# Altium schematic sheet stm32_project.SchDoc
size A1; SheetNumber: 1; SheetTotal: 1
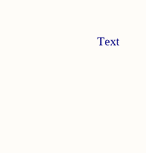
[diagram p0: stm32_project.SchDoc, top left]
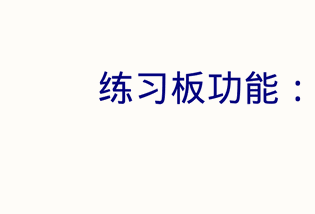
[diagram p1: stm32_project.SchDoc, top right]
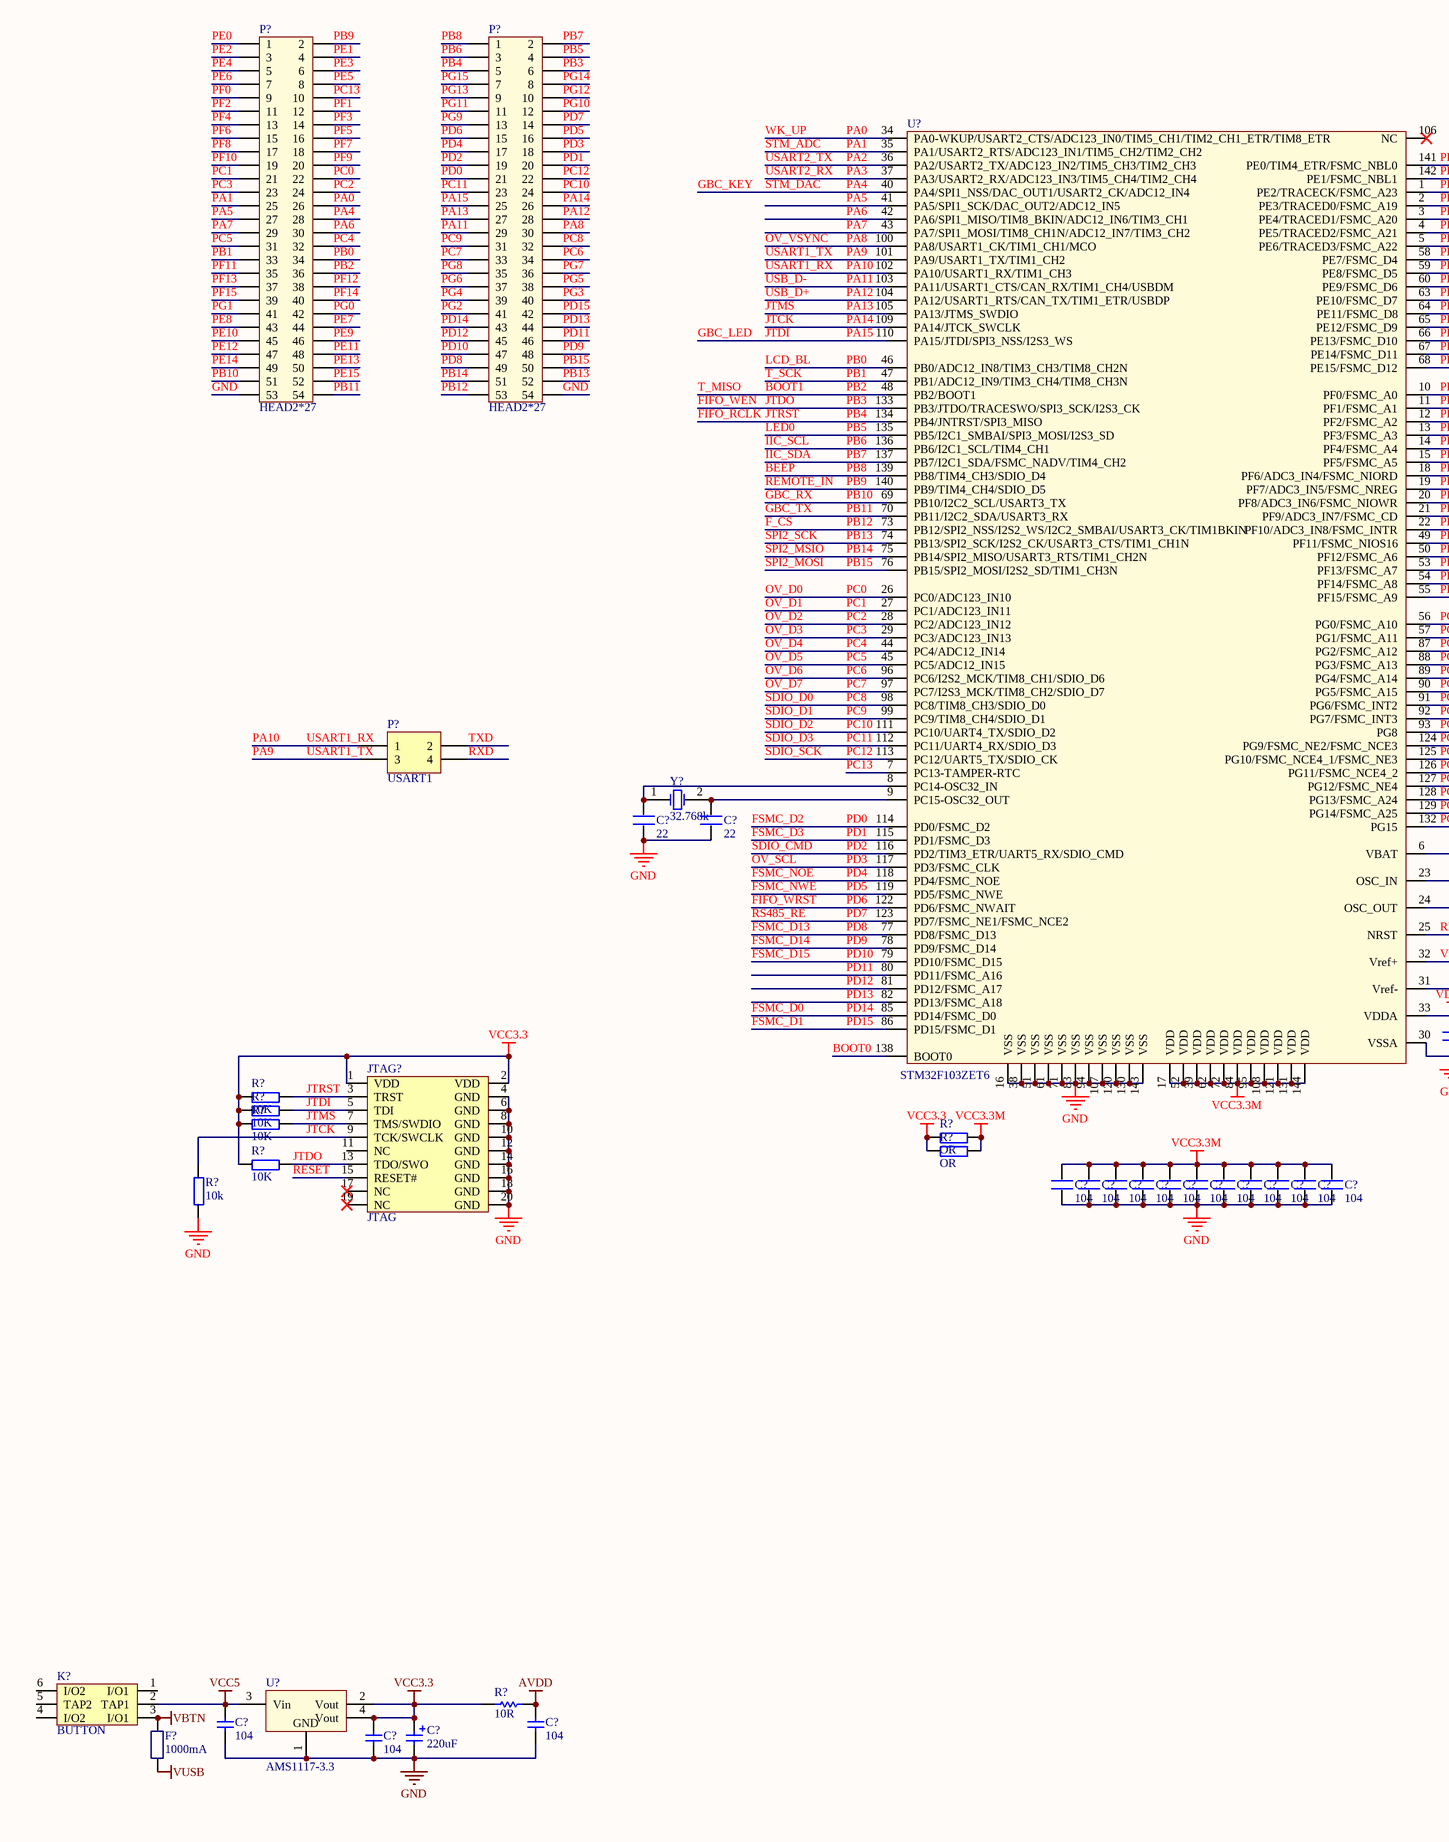
[diagram p2: stm32_project.SchDoc, bottom left]
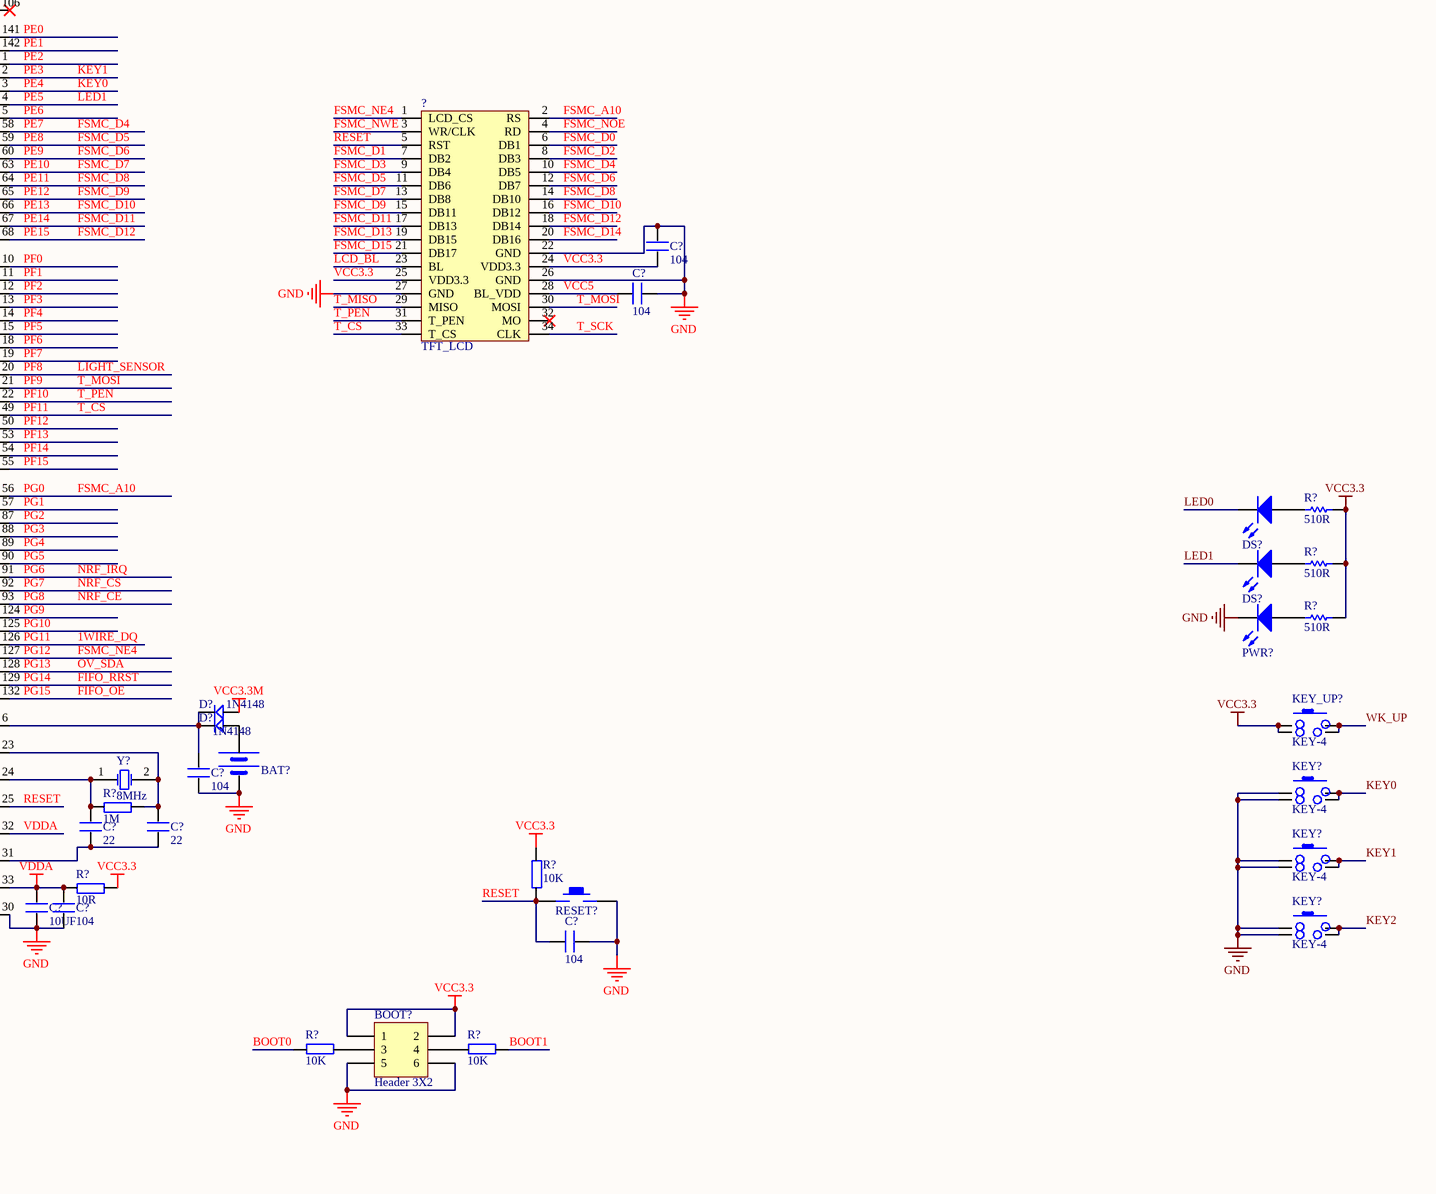
[diagram p3: stm32_project.SchDoc, bottom right]

## Parts
(Parts that share a designator on the sheet are numbered #1, #2 ... from top to bottom, then left to right.)
?  TFT_LCD  [db2*17-4.3]
BAT?  BATT  [CR1220_B]  (value not drawn)
BOOT?  Header 3X2  [HDR-3X2]
C?#1  104  [C 0603]
C?#2  104  [C 0603]
C?#3  22  [C 0603]
C?#4  22  [C 0603]
C?#5  104  [C 0603]
C?#6  22  [C 0603]
C?#7  22  [C 0603]
C?#8  104  [C 0603]
C?#9  10UF  [C 0805]
C?#10  104  [C 0603]
C?#11  104  [C 0603]
C?#12  104  [C 0603]
C?#13  104  [C 0603]
C?#14  104  [C 0603]
C?#15  104  [C 0603]
C?#16  104  [C 0603]
C?#17  104  [C 0603]
C?#18  104  [C 0603]
C?#19  104  [C 0603]
C?#20  104  [C 0603]
C?#21  104  [C 0603]
C?#22  104  [CAP[0603]]
C?#23  220uF  [R_6_3_h_7_7]
C?#24  104  [CAP[0603]]
C?#25  104  [CAP[0603]]
D?#1  1N4148  [MINI_MELF (LL34)]
D?#2  1N4148  [MINI_MELF (LL34)]
DS?#1  LED  [LED[0805]]  (value not drawn)
DS?#2  LED  [LED[0805]]  (value not drawn)
F?  1000mA  [PTC[0805]]
JTAG?  JTAG  [IDC2.54-20P]
K?  BUTTON  [KEY-6]
KEY?#1  KEY-4  [KEY-4(DIP)]
KEY?#2  KEY-4  [KEY-4(DIP)]
KEY?#3  KEY-4  [KEY-4(DIP)]
KEY_UP?  KEY-4  [KEY-4(DIP)]
P?#1  HEAD2*27  [HEAD2*27]
P?#2  HEAD2*27  [HEAD2*27]
P?#3  USART1  [HDR-2X2]
PWR?  LED  [LED[0805]]  (value not drawn)
R?#1  510R  [RES[0603]]
R?#2  510R  [RES[0603]]
R?#3  510R  [RES[0603]]
R?#4  1M  [R 0603]
R?#5  10R  [R 0603]
R?#6  10K  [R 0603]
R?#7  10K  [R 0603]
R?#8  10K  [R 0603]
R?#9  OR  [R 0603]
R?#10  OR  [R 0603]
R?#11  10K  [R 0603]
R?#12  10K  [R 0603]
R?#13  10K  [R 0603]
R?#14  10K  [R 0603]
R?#15  10k  [R 0603]
R?#16  10R  [RES[0603]]
RESET?  KEY_M  [TSW DIP-6*6*5]  (value not drawn)
U?#1  STM32F103ZET6  [TQFP144 20x20_L]
U?#2  AMS1117-3.3  [SOT-223(AMS1117-3.3)]
Y?#1  32.768k  [XTAL32]
Y?#2  8MHz  [XTAL-49S DIP]

## Nets
AVDD: C?#24.2 R?#16.2
GND: ?.22(GND) ?.26(GND) ?.27(GND) BAT?.2(GND) BOOT?.5 BOOT?.6 C?#1.1 C?#2.1 C?#3.1 C?#4.1 C?#5.1 C?#8.2 C?#9.1 C?#10.1 C?#11.1 C?#12.1 C?#13.1 C?#14.1 C?#15.1 C?#16.1 C?#17.1 C?#18.1 C?#19.1 C?#20.1 C?#21.1 C?#22.1 C?#23.2 C?#24.1 C?#25.1 JTAG?.4(GND) JTAG?.6(GND) JTAG?.8(GND) JTAG?.10(GND) JTAG?.12(GND) JTAG?.14(GND) JTAG?.16(GND) JTAG?.18(GND) JTAG?.20(GND) KEY?#1.1 KEY?#1.2 KEY?#2.1 KEY?#2.2 KEY?#3.1 KEY?#3.2 P?#1.53 P?#2.54 PWR?.2(K) R?#15.1 RESET?.2 U?#1.16(VSS) U?#1.30(VSSA) U?#1.38(VSS) U?#1.51(VSS) U?#1.61(VSS) U?#1.71(VSS) U?#1.83(VSS) U?#1.94(VSS) U?#1.107(VSS) U?#1.120(VSS) U?#1.130(VSS) U?#1.143(VSS) U?#2.1(GND)
VBTN: F?.2 K?.3(I/O1)
VCC3.3: ?.24(VDD3.3) ?.25(VDD3.3) BOOT?.1 BOOT?.2 C?#1.2 C?#23.1 C?#25.2 JTAG?.1(VDD) JTAG?.2(VDD) KEY_UP?.1 KEY_UP?.2 R?#1.2 R?#2.2 R?#3.2 R?#5.2 R?#6.1 R?#7.1 R?#8.1 R?#9.1 R?#10.1 R?#11.1 R?#12.2 R?#16.1 U?#2.2(Vout) U?#2.4(Vout)
VCC3.3M: C?#11.2 C?#12.2 C?#13.2 C?#14.2 C?#15.2 C?#16.2 C?#17.2 C?#18.2 C?#19.2 C?#20.2 C?#21.2 D?#1.1 R?#9.2 R?#10.2 U?#1.17(VDD) U?#1.39(VDD) U?#1.52(VDD) U?#1.62(VDD) U?#1.72(VDD) U?#1.84(VDD) U?#1.95(VDD) U?#1.108(VDD) U?#1.121(VDD) U?#1.131(VDD) U?#1.144(VDD)
VCC5: ?.28(BL_VDD) C?#2.2 C?#22.2 K?.2(TAP1) U?#2.3(Vin)
VDDA: C?#9.2 C?#10.2 R?#5.1 U?#1.32(Vref+) U?#1.33(VDDA)
VUSB: F?.1
1WIRE_DQ: P?#2.11 U?#1.126(PG11/FSMC_NCE4_2)  [also labelled PG11]
BEEP: P?#2.1 U?#1.139(PB8/TIM4_CH3/SDIO_D4)  [also labelled PB8]
BOOT0: R?#13.2 U?#1.138(BOOT0)
BOOT1: ?.29(MISO) P?#1.36 R?#14.1 U?#1.48(PB2/BOOT1)  [also labelled PB2, T_MISO]
F_CS: P?#2.53 U?#1.73(PB12/SPI2_NSS/I2S2_WS/I2C2_SMBAI/USART3_CK/TIM1BKIN)  [also labelled PB12]
FIFO_OE: P?#2.7 U?#1.132(PG15)  [also labelled PG15]
FIFO_RCLK: JTAG?.3(TRST) P?#2.5 R?#6.2 U?#1.134(PB4/JNTRST/SPI3_MISO)  [also labelled JTRST, PB4]
FIFO_RRST: P?#2.8 U?#1.129(PG14/FSMC_A25)  [also labelled PG14]
FIFO_WEN: JTAG?.13(TDO/SWO) P?#2.6 R?#11.2 U?#1.133(PB3/JTDO/TRACESWO/SPI3_SCK/I2S3_CK)  [also labelled JTDO, PB3]
FIFO_WRST: P?#2.15 U?#1.122(PD6/FSMC_NWAIT)  [also labelled PD6]
FSMC_A10: ?.2(RS) P?#1.42 U?#1.56(PG0/FSMC_A10)  [also labelled PG0]
FSMC_D0: ?.6(DB1) P?#2.43 U?#1.85(PD14/FSMC_D0)  [also labelled PD14]
FSMC_D1: ?.7(DB2) P?#2.42 U?#1.86(PD15/FSMC_D1)  [also labelled PD15]
FSMC_D2: ?.8(DB3) P?#2.21 U?#1.114(PD0/FSMC_D2)  [also labelled PD0]
FSMC_D3: ?.9(DB4) P?#2.20 U?#1.115(PD1/FSMC_D3)  [also labelled PD1]
FSMC_D4: ?.10(DB5) P?#1.44 U?#1.58(PE7/FSMC_D4)  [also labelled PE7]
FSMC_D5: ?.11(DB6) P?#1.43 U?#1.59(PE8/FSMC_D5)  [also labelled PE8]
FSMC_D6: ?.12(DB7) P?#1.46 U?#1.60(PE9/FSMC_D6)  [also labelled PE9]
FSMC_D7: ?.13(DB8) P?#1.45 U?#1.63(PE10/FSMC_D7)  [also labelled PE10]
FSMC_D8: ?.14(DB10) P?#1.48 U?#1.64(PE11/FSMC_D8)  [also labelled PE11]
FSMC_D9: ?.15(DB11) P?#1.47 U?#1.65(PE12/FSMC_D9)  [also labelled PE12]
FSMC_D10: ?.16(DB12) P?#1.50 U?#1.66(PE13/FSMC_D10)  [also labelled PE13]
FSMC_D11: ?.17(DB13) P?#1.49 U?#1.67(PE14/FSMC_D11)  [also labelled PE14]
FSMC_D12: ?.18(DB14) P?#1.52 U?#1.68(PE15/FSMC_D12)  [also labelled PE15]
FSMC_D13: ?.19(DB15) P?#2.49 U?#1.77(PD8/FSMC_D13)  [also labelled PD8]
FSMC_D14: ?.20(DB16) P?#2.48 U?#1.78(PD9/FSMC_D14)  [also labelled PD9]
FSMC_D15: ?.21(DB17) P?#2.47 U?#1.79(PD10/FSMC_D15)  [also labelled PD10]
FSMC_NE4: ?.1(LCD_CS) P?#2.10 U?#1.127(PG12/FSMC_NE4)  [also labelled PG12]
FSMC_NOE: ?.4(RD) P?#2.17 U?#1.118(PD4/FSMC_NOE)  [also labelled PD4]
FSMC_NWE: ?.3(WR/CLK) P?#2.16 U?#1.119(PD5/FSMC_NWE)  [also labelled PD5]
GBC_KEY: P?#1.28 U?#1.40(PA4/SPI1_NSS/DAC_OUT1/USART2_CK/ADC12_IN4)  [also labelled PA4, STM_DAC]
GBC_LED: JTAG?.5(TDI) P?#2.25 R?#7.2 U?#1.110(PA15/JTDI/SPI3_NSS/I2S3_WS)  [also labelled JTDI, PA15]
GBC_RX: P?#1.51 U?#1.69(PB10/I2C2_SCL/USART3_TX)  [also labelled PB10]
GBC_TX: P?#1.54 U?#1.70(PB11/I2C2_SDA/USART3_RX)  [also labelled PB11]
IIC_SCL: P?#2.3 U?#1.136(PB6/I2C1_SCL/TIM4_CH1)  [also labelled PB6]
IIC_SDA: P?#2.2 U?#1.137(PB7/I2C1_SDA/FSMC_NADV/TIM4_CH2)  [also labelled PB7]
JTCK: JTAG?.9(TCK/SWCLK) P?#2.26 R?#15.2 U?#1.109(PA14/JTCK_SWCLK)  [also labelled PA14]
JTMS: JTAG?.7(TMS/SWDIO) P?#2.27 R?#8.2 U?#1.105(PA13/JTMS_SWDIO)  [also labelled PA13]
KEY0: KEY?#1.3 KEY?#1.4 P?#1.5 U?#1.3(PE4/TRACED1/FSMC_A20)  [also labelled PE4]
KEY1: KEY?#2.3 KEY?#2.4 P?#1.6 U?#1.2(PE3/TRACED0/FSMC_A19)  [also labelled PE3]
KEY2: KEY?#3.3 KEY?#3.4
LCD_BL: ?.23(BL) P?#1.34 U?#1.46(PB0/ADC12_IN8/TIM3_CH3/TIM8_CH2N)  [also labelled PB0]
LED0: DS?#1.2(K) P?#2.4 U?#1.135(PB5/I2C1_SMBAI/SPI3_MOSI/I2S3_SD)  [also labelled PB5]
LED1: DS?#2.2(K) P?#1.8 U?#1.4(PE5/TRACED2/FSMC_A21)  [also labelled PE5]
LIGHT_SENSOR: P?#1.17 U?#1.20(PF8/ADC3_IN6/FSMC_NIOWR)  [also labelled PF8]
NRF_CE: P?#2.35 U?#1.93(PG8)  [also labelled PG8]
NRF_CS: P?#2.36 U?#1.92(PG7/FSMC_INT3)  [also labelled PG7]
NRF_IRQ: P?#2.37 U?#1.91(PG6/FSMC_INT2)  [also labelled PG6]
OV_D0: P?#1.22 U?#1.26(PC0/ADC123_IN10)  [also labelled PC0]
OV_D1: P?#1.21 U?#1.27(PC1/ADC123_IN11)  [also labelled PC1]
OV_D2: P?#1.24 U?#1.28(PC2/ADC123_IN12)  [also labelled PC2]
OV_D3: P?#1.23 U?#1.29(PC3/ADC123_IN13)  [also labelled PC3]
OV_D4: P?#1.32 U?#1.44(PC4/ADC12_IN14)  [also labelled PC4]
OV_D5: P?#1.31 U?#1.45(PC5/ADC12_IN15)  [also labelled PC5]
OV_D6: P?#2.34 U?#1.96(PC6/I2S2_MCK/TIM8_CH1/SDIO_D6)  [also labelled PC6]
OV_D7: P?#2.33 U?#1.97(PC7/I2S3_MCK/TIM8_CH2/SDIO_D7)  [also labelled PC7]
OV_SCL: P?#2.18 U?#1.117(PD3/FSMC_CLK)  [also labelled PD3]
OV_SDA: P?#2.9 U?#1.128(PG13/FSMC_A24)  [also labelled PG13]
OV_VSYNC: P?#2.30 U?#1.100(PA8/USART1_CK/TIM1_CH1/MCO)  [also labelled PA8]
PA0: KEY_UP?.3 KEY_UP?.4 P?#1.26 U?#1.34(PA0-WKUP/USART2_CTS/ADC123_IN0/TIM5_CH1/TIM2_CH1_ETR/TIM8_ETR)  [also labelled WK_UP]
PA1: P?#1.25 U?#1.35(PA1/USART2_RTS/ADC123_IN1/TIM5_CH2/TIM2_CH2)  [also labelled STM_ADC]
PA2: U?#1.36(PA2/USART2_TX/ADC123_IN2/TIM5_CH3/TIM2_CH3)  [also labelled USART2_TX]
PA3: U?#1.37(PA3/USART2_RX/ADC123_IN3/TIM5_CH4/TIM2_CH4)  [also labelled USART2_RX]
PA5: P?#1.27 U?#1.41(PA5/SPI1_SCK/DAC_OUT2/ADC12_IN5)
PA6: P?#1.30 U?#1.42(PA6/SPI1_MISO/TIM8_BKIN/ADC12_IN6/TIM3_CH1)
PA7: P?#1.29 U?#1.43(PA7/SPI1_MOSI/TIM8_CH1N/ADC12_IN7/TIM3_CH2)
PA9: P?#3.3 U?#1.101(PA9/USART1_TX/TIM1_CH2)  [also labelled USART1_TX]
PA10: P?#3.1 U?#1.102(PA10/USART1_RX/TIM1_CH3)  [also labelled USART1_RX]
PA11: P?#2.29 U?#1.103(PA11/USART1_CTS/CAN_RX/TIM1_CH4/USBDM)  [also labelled USB_D-]
PA12: P?#2.28 U?#1.104(PA12/USART1_RTS/CAN_TX/TIM1_ETR/USBDP)  [also labelled USB_D+]
PB1: ?.34(CLK) P?#1.33 U?#1.47(PB1/ADC12_IN9/TIM3_CH4/TIM8_CH3N)  [also labelled T_SCK]
PB9: P?#1.2 U?#1.140(PB9/TIM4_CH4/SDIO_D5)  [also labelled REMOTE_IN]
PB13: P?#2.52 U?#1.74(PB13/SPI2_SCK/I2S2_CK/USART3_CTS/TIM1_CH1N)  [also labelled SPI2_SCK]
PB14: P?#2.51 U?#1.75(PB14/SPI2_MISO/USART3_RTS/TIM1_CH2N)  [also labelled SPI2_MSIO]
PB15: P?#2.50 U?#1.76(PB15/SPI2_MOSI/I2S2_SD/TIM1_CH3N)  [also labelled SPI2_MOSI]
PC8: P?#2.32 U?#1.98(PC8/TIM8_CH3/SDIO_D0)  [also labelled SDIO_D0]
PC9: P?#2.31 U?#1.99(PC9/TIM8_CH4/SDIO_D1)  [also labelled SDIO_D1]
PC10: P?#2.24 U?#1.111(PC10/UART4_TX/SDIO_D2)  [also labelled SDIO_D2]
PC11: P?#2.23 U?#1.112(PC11/UART4_RX/SDIO_D3)  [also labelled SDIO_D3]
PC12: P?#2.22 U?#1.113(PC12/UART5_TX/SDIO_CK)  [also labelled SDIO_SCK]
PC13: P?#1.10 U?#1.7(PC13-TAMPER-RTC)
PD2: P?#2.19 U?#1.116(PD2/TIM3_ETR/UART5_RX/SDIO_CMD)  [also labelled SDIO_CMD]
PD7: P?#2.14 U?#1.123(PD7/FSMC_NE1/FSMC_NCE2)  [also labelled RS485_RE]
PD11: P?#2.46 U?#1.80(PD11/FSMC_A16)
PD12: P?#2.45 U?#1.81(PD12/FSMC_A17)
PD13: P?#2.44 U?#1.82(PD13/FSMC_A18)
PE0: P?#1.1 U?#1.141(PE0/TIM4_ETR/FSMC_NBL0)
PE1: P?#1.4 U?#1.142(PE1/FSMC_NBL1)
PE2: P?#1.3 U?#1.1(PE2/TRACECK/FSMC_A23)
PE6: P?#1.7 U?#1.5(PE6/TRACED3/FSMC_A22)
PF0: P?#1.9 U?#1.10(PF0/FSMC_A0)
PF1: P?#1.12 U?#1.11(PF1/FSMC_A1)
PF2: P?#1.11 U?#1.12(PF2/FSMC_A2)
PF3: P?#1.14 U?#1.13(PF3/FSMC_A3)
PF4: P?#1.13 U?#1.14(PF4/FSMC_A4)
PF5: P?#1.16 U?#1.15(PF5/FSMC_A5)
PF6: P?#1.15 U?#1.18(PF6/ADC3_IN4/FSMC_NIORD)
PF7: P?#1.18 U?#1.19(PF7/ADC3_IN5/FSMC_NREG)
PF9: ?.30(MOSI) P?#1.20 U?#1.21(PF9/ADC3_IN7/FSMC_CD)  [also labelled T_MOSI]
PF10: ?.31(T_PEN) P?#1.19 U?#1.22(PF10/ADC3_IN8/FSMC_INTR)  [also labelled T_PEN]
PF11: ?.33(T_CS) P?#1.35 U?#1.49(PF11/FSMC_NIOS16)  [also labelled T_CS]
PF12: P?#1.38 U?#1.50(PF12/FSMC_A6)
PF13: P?#1.37 U?#1.53(PF13/FSMC_A7)
PF14: P?#1.40 U?#1.54(PF14/FSMC_A8)
PF15: P?#1.39 U?#1.55(PF15/FSMC_A9)
PG1: P?#1.41 U?#1.57(PG1/FSMC_A11)
PG2: P?#2.41 U?#1.87(PG2/FSMC_A12)
PG3: P?#2.40 U?#1.88(PG3/FSMC_A13)
PG4: P?#2.39 U?#1.89(PG4/FSMC_A14)
PG5: P?#2.38 U?#1.90(PG5/FSMC_A15)
PG9: P?#2.13 U?#1.124(PG9/FSMC_NE2/FSMC_NCE3)
PG10: P?#2.12 U?#1.125(PG10/FSMC_NCE4_1/FSMC_NE3)
RESET: ?.5(RST) C?#8.1 JTAG?.15(RESET#) R?#12.1 RESET?.1 U?#1.25(NRST)
RXD: P?#3.4
TXD: P?#3.2
NetBAT?_1: BAT?.1(VCC) D?#2.1
NetBOOT?_3: BOOT?.3 R?#13.1
NetBOOT?_4: BOOT?.4 R?#14.2
NetC?#3_2: C?#3.2 U?#1.8(PC14-OSC32_IN) Y?#1.1(OSC1)
NetC?#4_2: C?#4.2 U?#1.9(PC15-OSC32_OUT) Y?#1.2(OSC2)
NetC?#5_2: C?#5.2 D?#1.2 D?#2.2 U?#1.6(VBAT)
NetC?#6_1: C?#6.1 C?#7.1 U?#1.31(Vref-)
NetC?#6_2: C?#6.2 R?#4.1 U?#1.24(OSC_OUT) Y?#2.1(OSC1)
NetC?#7_2: C?#7.2 R?#4.2 U?#1.23(OSC_IN) Y?#2.2(OSC2)
NetDS?#1_1: DS?#1.1(A) R?#1.1
NetDS?#2_1: DS?#2.1(A) R?#2.1
NetPWR?_1: PWR?.1(A) R?#3.1

Not connected (* = marked no-connect by the designer): ? 32(MO)*; JTAG? 11(NC) 17(NC)* 19(NC)*; K? 1(I/O1) 4(I/O2) 5(TAP2) 6(I/O2); U?#1 106(NC)*

## Notes on the sheet
- Text
- 练习板功能：蓝牙、语音、OLED屏幕

## Library data of the parts
BAT? = BAT
BOOT? = Header 3X2: Header, 3-Pin, Dual row; LatestRevisionDate: 17-Jul-2002; LatestRevisionNote: Re-released for DXP Platform.; Publisher: Altium Limited
C?#1-C?#21 = C
C?#22 C?#24 C?#25 = Cap: Footprint: 104; VALUE: 104
C?#23 = Cap Pol: Footprint: 220uF; VALUE: 220uF
D?#1 D?#2 = D
F? = PTC
K? = KEY-6
P?#3 = Header 2X2: Header, 2-Pin, Dual row; LatestRevisionDate: 17-Jul-2002; LatestRevisionNote: Re-released for DXP Platform.; Publisher: Altium Limited
R?#1-R?#3 R?#16 = Res
  R?#1-R?#3: Footprit: 510R; VALUE: 510R
  R?#16: Footprit: 10R; VALUE: 10R
R?#4-R?#15 = R
Y?#1 Y?#2 = XTAL: Crystal Oscillator; Published: 8-Jun-2000; LatestRevisionDate: 17-Jul-2002; LatestRevisionNote: Re-released for DXP Platform.; Publisher: Altium Limited